# EAGLE design untitled (EAGLE 5.08)
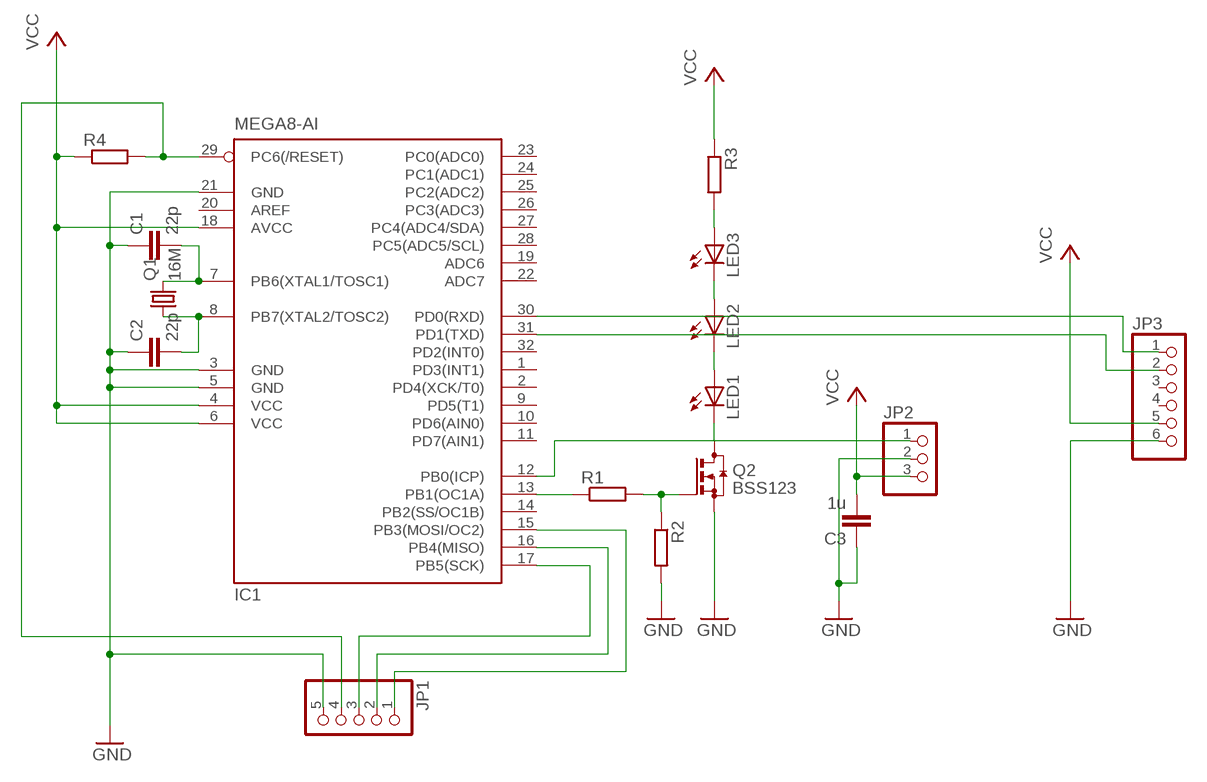
[diagram p0: schematic, sheet 1]

## Parts
C1  22p  C-EUC0805  [C0805]
C2  22p  C-EUC0805  [C0805]
C3  1u  C-EUC0805  [C0805]
IC1  MEGA8-AI  [TQFP32-08]
JP1  PINHD-1X5  [1X05]
JP2  PINHD-1X3  [1X03]
JP3  PINHD-1X6  [1X06]
LED1  LED5MM  [LED5MM]
LED2  LED5MM  [LED5MM]
LED3  LED5MM  [LED5MM]
Q1  16M  CRYSTALSM49  [SM49]
Q2  BSS123  [SOT23]
R1  R-EU_R0805  [R0805]
R2  R-EU_R0805  [R0805]
R3  R-EU_R0805  [R0805]
R4  R-EU_R0805  [R0805]

## Nets
GND: C1.1 C2.1 C3.1 IC1.3(GND) IC1.5(GND) IC1.21(GND) JP1.5 JP2.2 JP3.6 Q2.2(S) R2.2
N$1: LED1.K(C) Q2.3(D)
N$2: C2.2 IC1.8(PB7(XTAL2/TOSC2)) Q1.1
N$3: C1.2 IC1.7(PB6(XTAL1/TOSC1)) Q1.2
N$4: IC1.13(PB1(OC1A)) R1.1
N$5: Q2.1(G) R1.2 R2.1
N$6: LED1.A LED2.K(C)
N$7: LED2.A LED3.K(C)
N$8: LED3.A R3.2
N$9: IC1.29(PC6(/RESET)) JP1.4 R4.2
N$10: IC1.15(PB3(MOSI/OC2)) JP1.1
N$11: IC1.16(PB4(MISO)) JP1.2
N$12: IC1.17(PB5(SCK)) JP1.3
N$13: IC1.12(PB0(ICP)) JP2.1
N$17: IC1.31(PD1(TXD)) JP3.2
N$18: IC1.30(PD0(RXD)) JP3.1
VCC: C3.2 IC1.4(VCC) IC1.6(VCC) IC1.18(AVCC) JP2.3 JP3.5 R3.1 R4.1
Unconnected: IC1.1(PD3(INT1)) IC1.2(PD4(XCK/T0)) IC1.9(PD5(T1)) IC1.10(PD6(AIN0)) IC1.11(PD7(AIN1)) IC1.14(PB2(SS/OC1B)) IC1.19(ADC6) IC1.20(AREF) IC1.22(ADC7) IC1.23(PC0(ADC0)) IC1.24(PC1(ADC1)) IC1.25(PC2(ADC2)) IC1.26(PC3(ADC3)) IC1.27(PC4(ADC4/SDA)) IC1.28(PC5(ADC5/SCL)) IC1.32(PD2(INT0)) JP3.3 JP3.4

## Library data of the parts
C1-C3 = resistor:C-EU: CAPACITOR, European symbol
IC1 = atmel:MEGA8: MICROCONTROLLER 8 Kbytes FLASH, 1 kbytes SRAM, 512 bytes EEPROM, USART, 6-channel 10 bit ADC, 2-channel 8 bit ADC Pin compatible with Atmega48, ATMega88, ATMega168 Source: avr.lbr
JP1 = pinhead:PINHD-1X5: PIN HEADER
JP2 = pinhead:PINHD-1X3: PIN HEADER
JP3 = pinhead:PINHD-1X6: PIN HEADER
LED1-LED3 = led:LED: LED OSRAM: - CHIPLED LG R971, LG N971, LY N971, LG Q971, LY Q971, LO R971, LY R971 LH N974, LH R974 LS Q976, LO Q976, LY Q976 LO Q996 - Hyper CHIPLED LW Q18S LB Q993, LB Q99A, LB R99A - SideLED LS A670, LO A670, LY A670, LG A670, LP A670 LB A673, LV A673, LT A673, LW A673 LH A674 LY A675 LS A676, LA A676, LO A676, LY A676, LW A676 LS A679, LY A679, LG A679 - Hyper Micro SIDELED® LS Y876, LA Y876, LO Y876, LY Y876 LT Y87S - SmartLED LW L88C, LW L88S LB L89C, LB L89S, LG L890 LS L89K, LO L89K, LY L89K LS L896, LA L896, LO L896, LY L896 - TOPLED LS T670, LO T670, LY T670, LG T670, LP T670 LSG T670, LSP T670, LSY T670, LOP T670, LYG T670 LG T671, LOG T671, LSG T671 LB T673, LV T673, LT T673, LW T673 LH T674 LS T676, LA T676, LO T676, LY T676, LB T676, LH T676, LSB T676, LW T676 LB T67C, LV T67C, LT T67C, LS T67K, LO T67K, LY T67K, LW E67C LS E67B, LA E67B, LO E67B, LY E67B, LB E67C, LV E67C, LT E67C LW T67C LS T679, LY T679, LG T679 LS T770, LO T770, LY T770, LG T770, LP T770 LB T773, LV T773, LT T773, LW T773 LH T774 LS E675, LA E675, LY E675, LS T675 LS T776, LA T776, LO T776, LY T776, LB T776 LHGB T686 LT T68C, LB T68C - Hyper Mini TOPLED® LB M676 - Mini TOPLED Santana® LG M470 LS M47K, LO M47K, LY M47K Source: http://www.osram.convergy.de LUXEON: - LUMILED® LXK2-PW12-R00, LXK2-PW12-S00, LXK2-PW14-U00, LXK2-PW14-V00 LXK2-PM12-R00, LXK2-PM12-S00, LXK2-PM14-U00 LXK2-PE12-Q00, LXK2-PE12-R00, LXK2-PE12-S00, LXK2-PE14-T00, LXK2-PE14-U00 LXK2-PB12-K00, LXK2-PB12-L00, LXK2-PB12-M00, LXK2-PB14-N00, LXK2-PB14-P00, LXK2-PB14-Q00 LXK2-PR12-L00, LXK2-PR12-M00, LXK2-PR14-Q00, LXK2-PR14-R00 LXK2-PD12-Q00, LXK2-PD12-R00, LXK2-PD12-S00 LXK2-PH12-R00, LXK2-PH12-S00 LXK2-PL12-P00, LXK2-PL12-Q00, LXK2-PL12-R00 Source: www.luxeon.com KINGBRIGHT: KA-3528ASYC Source: www.kingbright.com
Q1 = crystal:CRYSTAL: CRYSTAL
Q2 = transistor-small-signal:BSS123: N-CHANNEL MOS FET
R1-R4 = resistor:R-EU_: RESISTOR, European symbol

## Board
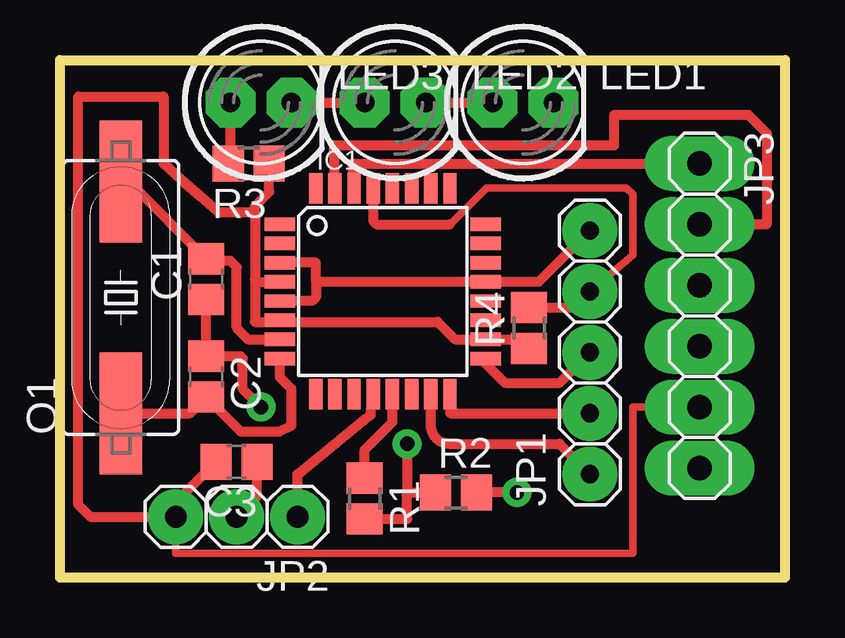
[diagram p1: board, top side]
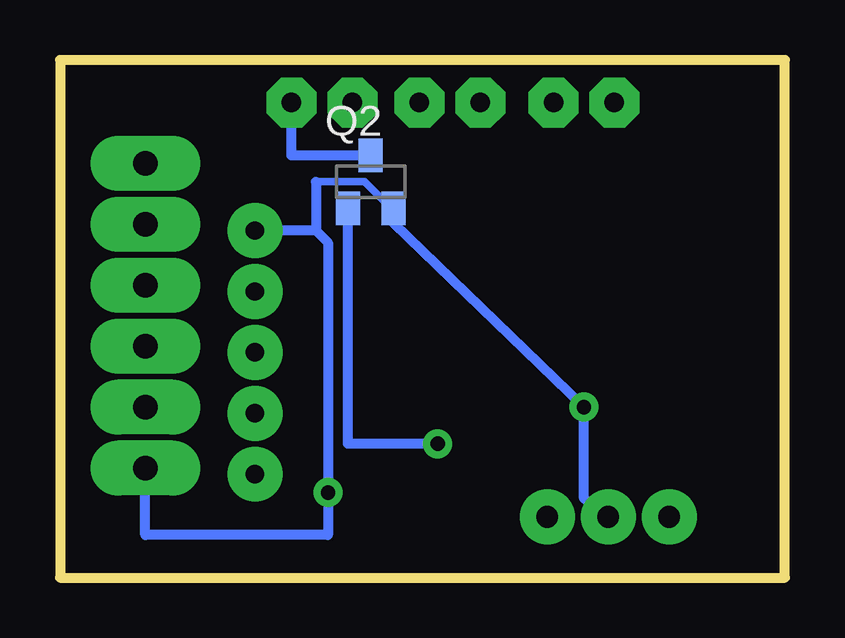
[diagram p2: board, bottom side, seen from below]

Size 30.23 x 21.59 mm. Coordinates in mm from the lower left corner, seen from the top.
Outline: 0,0 0,21.59 30.23,21.59 30.23,0 0,0
Copper layers (1*16): Top 0.035mm / dielectric 1.5mm / Bottom 0.035mm
Design rules "default *": minimum track width 0.2mm, minimum drill 0.2mm, track to track 0.2mm, track to pad 0.2mm, pad to pad 0.2mm, via to via 0.2mm, smd to smd 0.2mm, copper to edge 0.2mm, drill to drill 0.2mm, minimum pad ring 25mil, minimum via ring 12mil, stop-mask expansion 4mil, vias tented up to drill 0mil, thermal gap 10mil

### Footprints (pad centres in the part's own frame; a part is rotated, then mirrored left to right if it is on the bottom)
C0805 = smd 1.3 x 1.5: 1 -0.85,0; 2 0.85,0
TQFP32-08 = smd 1.27 x 0.559: 1 -4.293,2.8; 2 -4.293,2; 3 -4.293,1.2; 4 -4.293,0.4; 5 -4.293,-0.4; 6 -4.293,-1.2; 7 -4.293,-2; 8 -4.293,-2.8; 17 4.293,-2.8; 18 4.293,-2; 19 4.293,-1.2; 20 4.293,-0.4; 21 4.293,0.4; 22 4.293,1.2; 23 4.293,2; 24 4.293,2.8 | smd 0.559 x 1.27: 9 -2.8,-4.293; 10 -2,-4.293; 11 -1.2,-4.293; 12 -0.4,-4.293; 13 0.4,-4.293; 14 1.2,-4.293; 15 2,-4.293; 16 2.8,-4.293; 25 2.8,4.293; 26 2,4.293; 27 1.2,4.293; 28 0.4,4.293; 29 -0.4,4.293; 30 -1.2,4.293; 31 -2,4.293; 32 -2.8,4.293
1X05 = drill 0.762 pad 2.286 round: 1 -5.08,0; 2 -2.54,0; 3 0,0; 4 2.54,0; 5 5.08,0
1X03 = drill 0.9 pad 2.286 round: 1 -2.54,0; 2 0,0; 3 2.54,0
1X06 = drill 1.016 long: 1 -6.35,0; 2 -3.81,0; 3 -1.27,0; 4 1.27,0; 5 3.81,0; 6 6.35,0
LED5MM = drill 0.813 octagon: A -1.27,0; K 1.27,0
SM49 = smd 5.08 x 1.778: 1 -4.826,0; 2 4.826,0
SOT23 = smd 1 x 1.4: 1 -0.95,-1.1; 2 0.95,-1.1; 3 0,1.1
R0805 = smd 1.3 x 1.5: 1 -0.85,0; 2 0.85,0

### Placement (x,y rotation side)
C1  6.1,12.45 90 top
C2  6.1,8.38 270 top
C3  7.37,4.83 180 top
IC1  13.46,11.94 0 top
JP1  22.1,9.4 90 top
JP2  7.37,2.54 180 top
JP3  26.67,10.92 270 top
LED1  19.3,19.81 0 top
LED2  13.97,19.81 0 top
LED3  8.38,19.81 0 top
Q1  2.54,11.68 90 top
Q2  17.27,16.51 0 bottom
R1  12.7,3.3 270 top
R2  16.51,3.56 0 top
R3  7.87,17.27 180 top
R4  19.56,10.41 90 top

### Tracks (layer width: path | path; a pad name or v marks a point on that pad's centre or on a via)
GND  (via drill 0.6)
  Top 0.406: IC1.3 10.67,13.14 10.67,12.45 | 10.67,12.45 10.67,11.68 10.52,11.54 IC1.5 | 10.67,12.45 arc90 10.78,12.34 IC1.21 19.96,12.34 JP1.5 | C2.1 C1.1 | C2.1 6.1,9.11 | v19.05,3.56 R2.2 | v8.38,7.11 7.62,7.87 7.62,9.14 7.53,9.23 C2.1 | C3.1 8.22,3.39 JP2.2
  Bottom 0.305: 16.43,15.41 17.53,16.51 19.56,16.51
  Bottom 0.406: 16.43,15.41 Q2.2 16.32,14.8 v8.38,7.11 8.38,3.3 JP2.2 | 19.56,14.48 19.05,13.97 v19.05,3.56 19.05,1.78 26.67,1.78 JP3.6 | 19.56,14.48 JP1.5 | 19.56,16.51 19.56,14.48
N$1
  Bottom 0.406: Q2.3 20.57,17.61 LED1.K
N$2
  Top 0.406: IC1.8 9.17,8.36 9.65,7.87 9.65,6.35 9.14,6.1 7.53,6.1 C2.2 5.42,6.86 Q1.1
N$3
  Top 0.406: Q1.2 2.88,16.51 C1.2 6.18,13.21 7.11,13.21 7.37,12.95 7.37,10.41 7.84,9.94 IC1.7
N$4
  Top 0.406: R1.1 12.7,5.33 13.86,6.5 IC1.13
N$5  (via drill 0.6)
  Top 0.406: v14.48,5.59 14.48,3.56 | 14.48,3.56 R2.1 | R1.2 14.48,2.45 14.48,3.56
  Bottom 0.406: Q2.1 18.22,5.59 v14.48,5.59
N$6
  Top 0.406: LED2.K LED1.A
N$7
  Top 0.406: LED3.K LED2.A
N$8
  Top 0.406: LED3.A 7.11,17.69 R3.2
N$9
  Top 0.305: 16.26,14.73 17.78,16.26 23.62,16.26 23.88,16 23.88,13.46 JP1.4
  Top 0.406: IC1.29 13.06,14.88 13.21,14.73 16.26,14.73 | R4.2 21.42,11.26 JP1.4
N$10
  Top 0.406: IC1.15 15.46,6.35 arc90 16.22,5.59 20.83,5.59 JP1.1
N$11
  Top 0.406: IC1.16 16.26,6.86 JP1.2
N$12
  Top 0.406: IC1.17 17.75,8.91 18.54,8.13 20.83,8.13 JP1.3
N$13
  Top 0.406: JP2.1 9.91,4.32 12.7,6.6 12.95,6.78 IC1.12
N$17
  Top 0.406: IC1.31 11.43,18.03 23.11,18.03 23.11,19.3 28.7,19.3 29.46,18.54 29.46,14.73 JP3.2
N$18
  Top 0.406: IC1.30 12.19,17.27 JP3.1
VCC
  Top 0.305: JP3.5 23.88,7.11 23.88,1.02 4.83,1.02 JP2.3
  Top 0.406: R3.1 8.72,16.09 8.13,15.49 8.13,15.24 | 8.13,12.45 8.13,10.67 9.1,10.67 IC1.6 9.24,10.67 15.75,10.67 16.48,9.94 IC1.18 19.44,9.94 R4.1 | 8.13,15.24 8.13,12.45 | IC1.4 8.24,12.34 8.13,12.45 | 8.13,15.24 6.6,15.24 arc-2 4.32,17.27 4.32,20.07 0.76,20.07 0.76,3.05 1.27,2.54 JP2.3 4.83,3.14 C3.2